# Altium schematic sheet LEL UDS.SchDoc
size A0
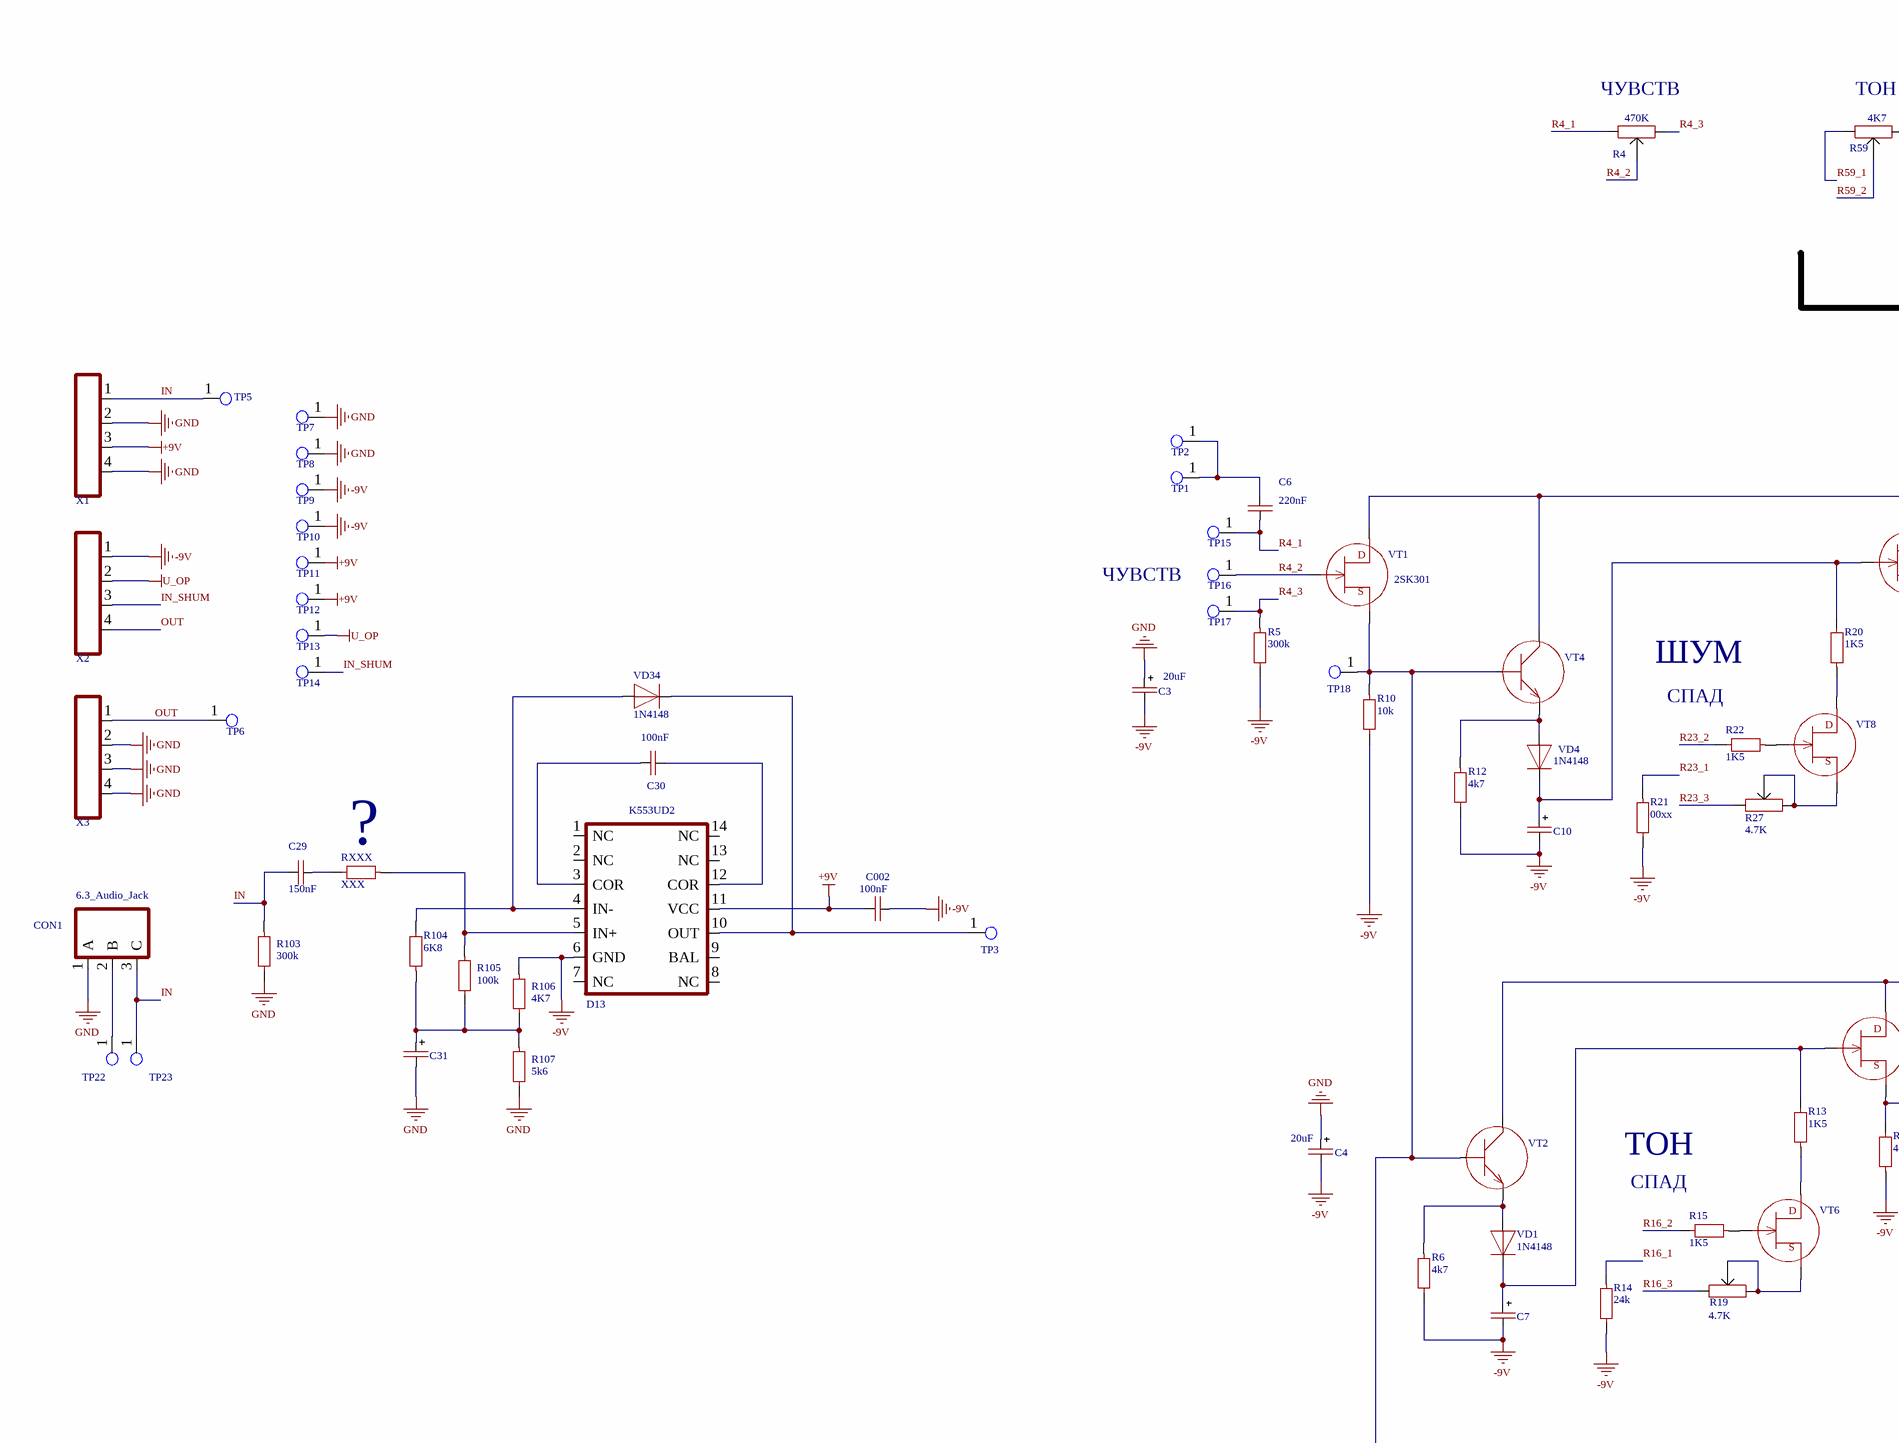
[diagram p0: LEL UDS.SchDoc, top left]
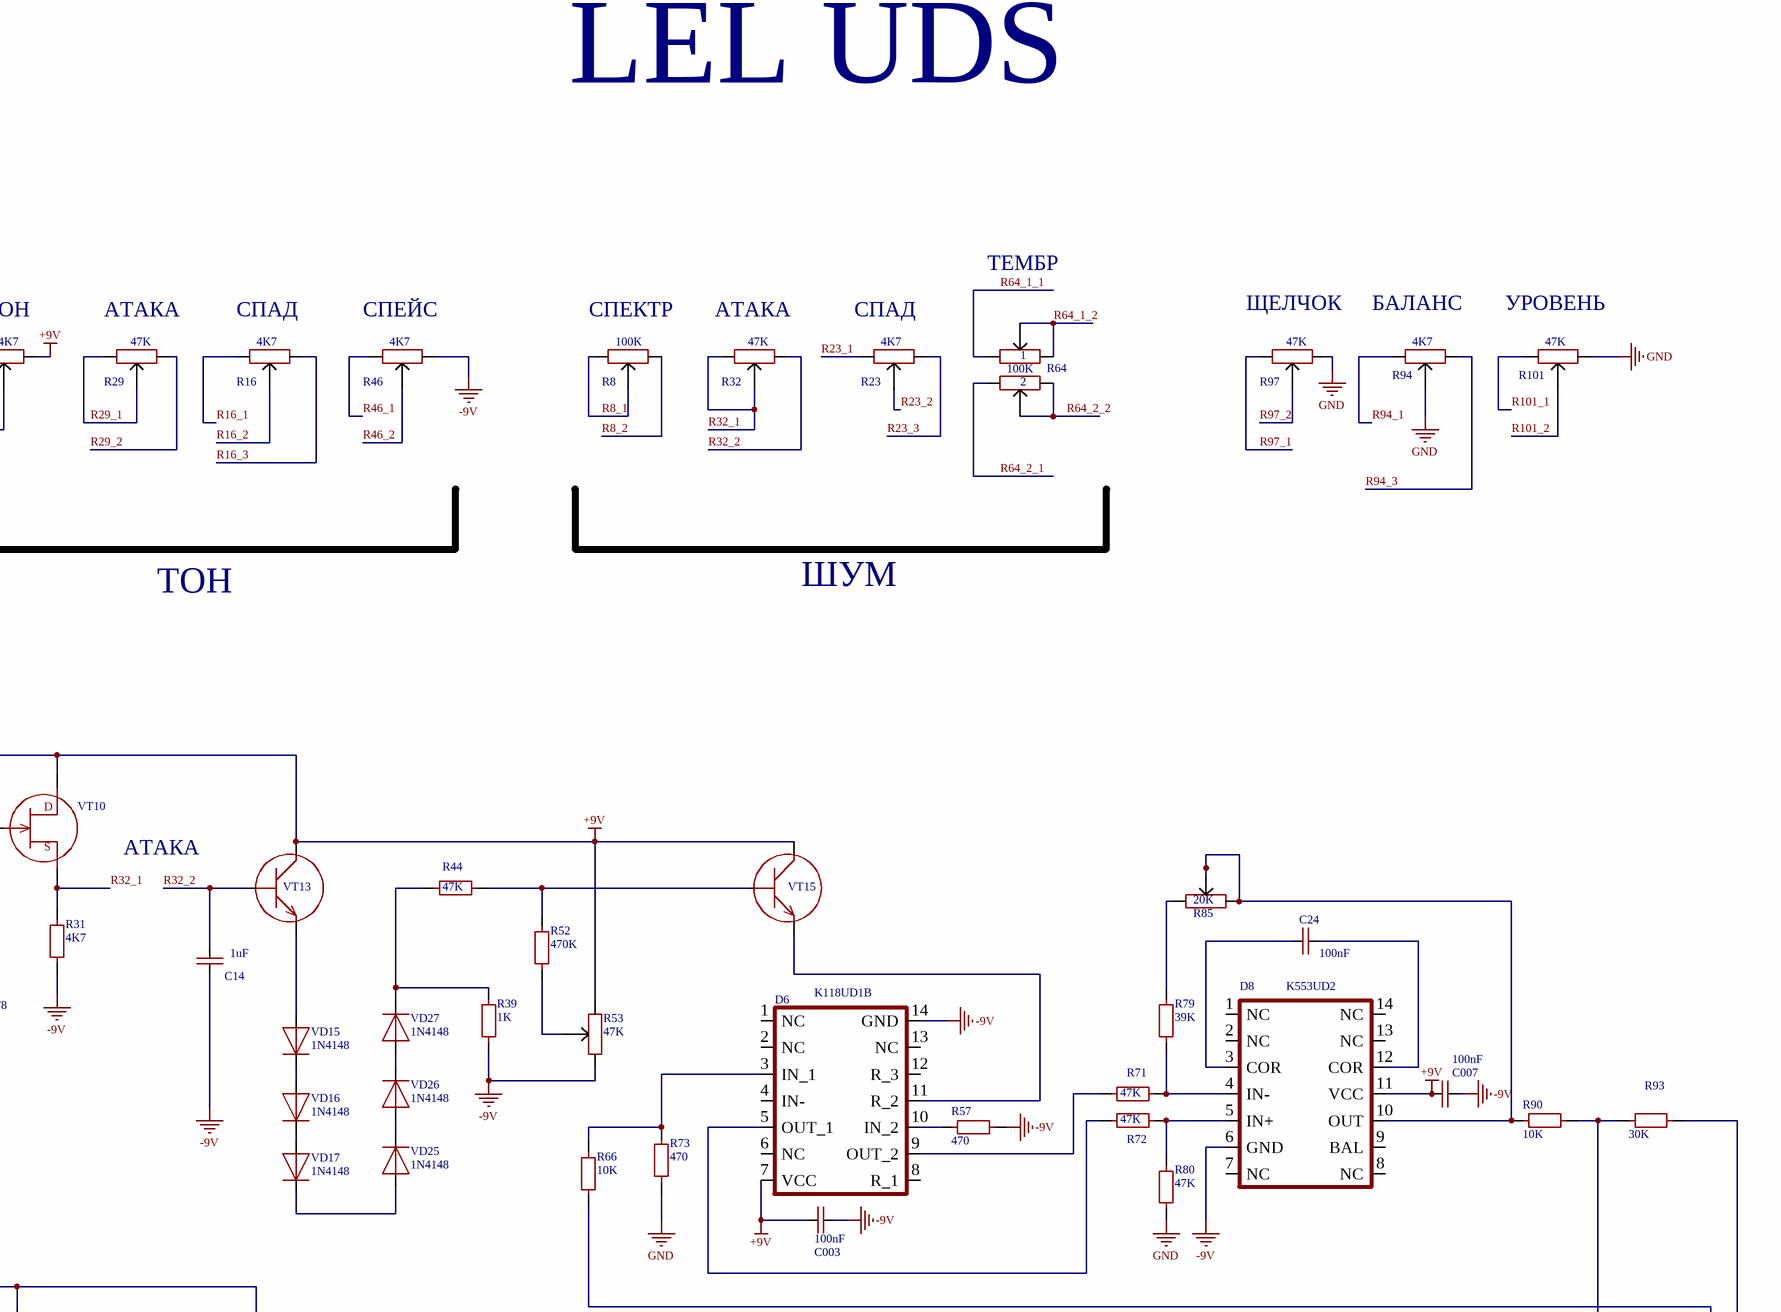
[diagram p1: LEL UDS.SchDoc, top right]
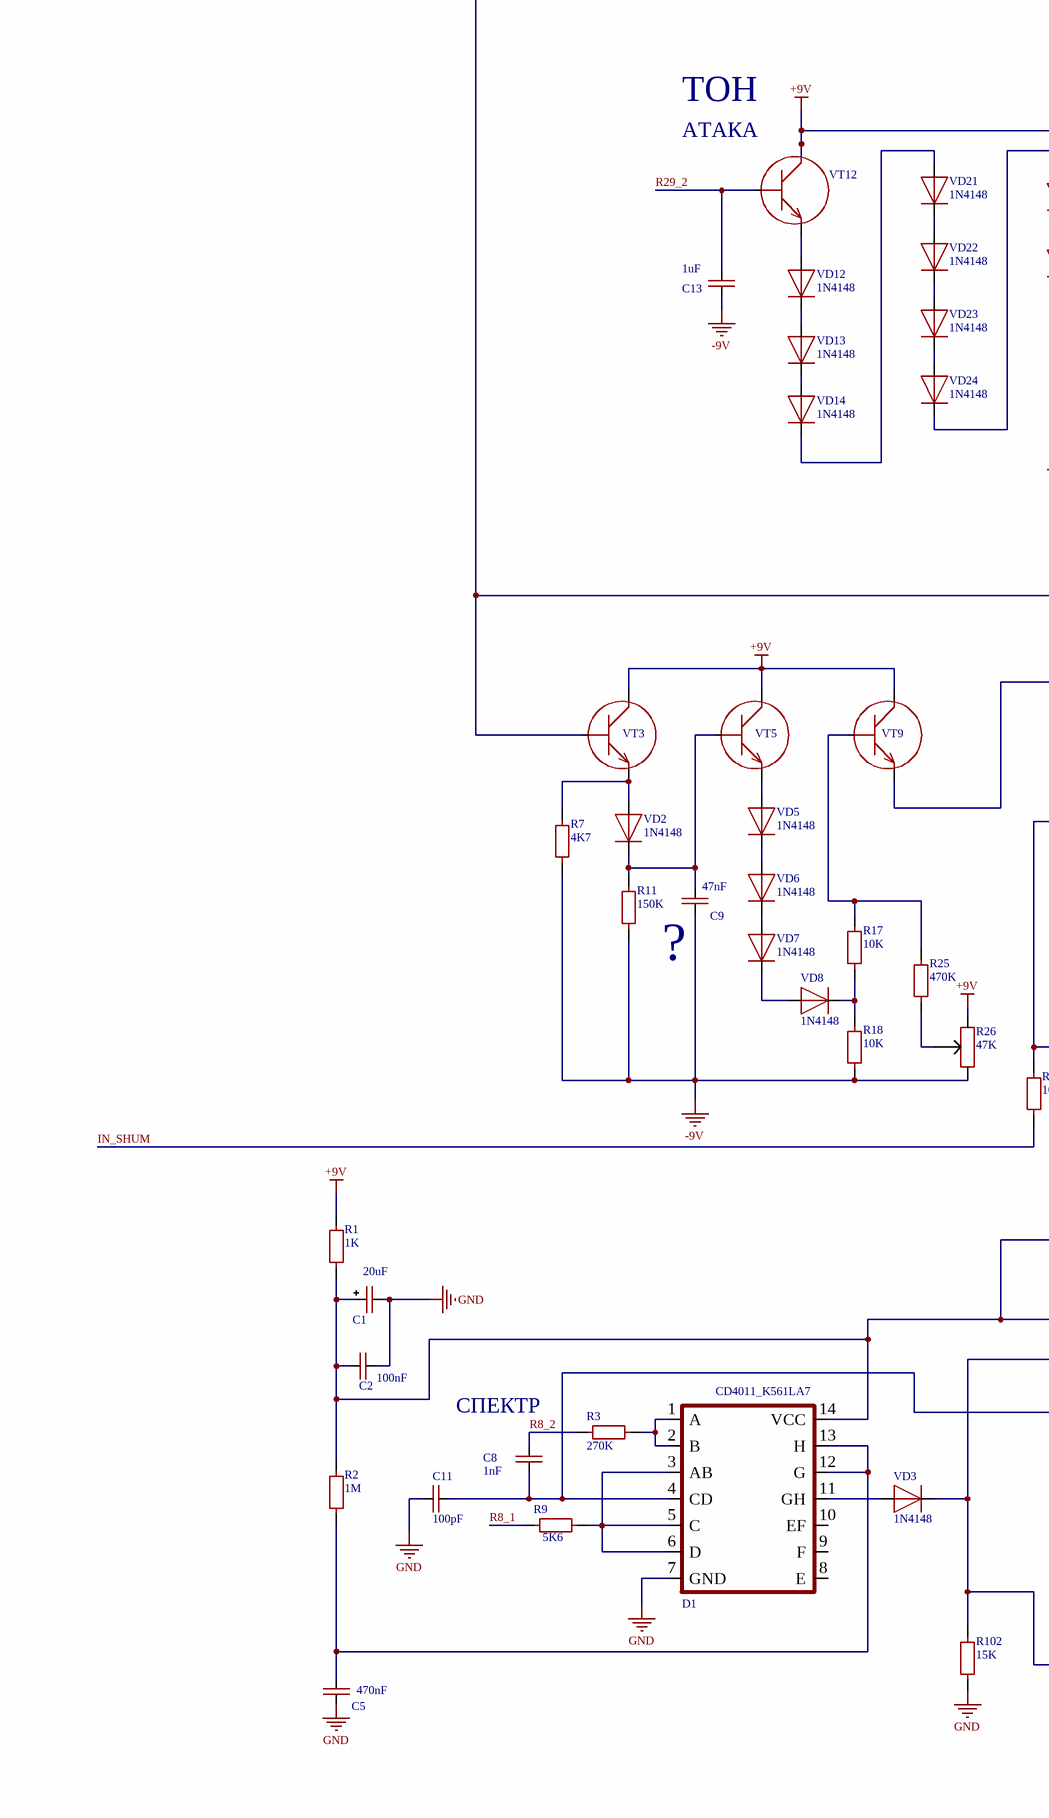
[diagram p2: LEL UDS.SchDoc, bottom left]
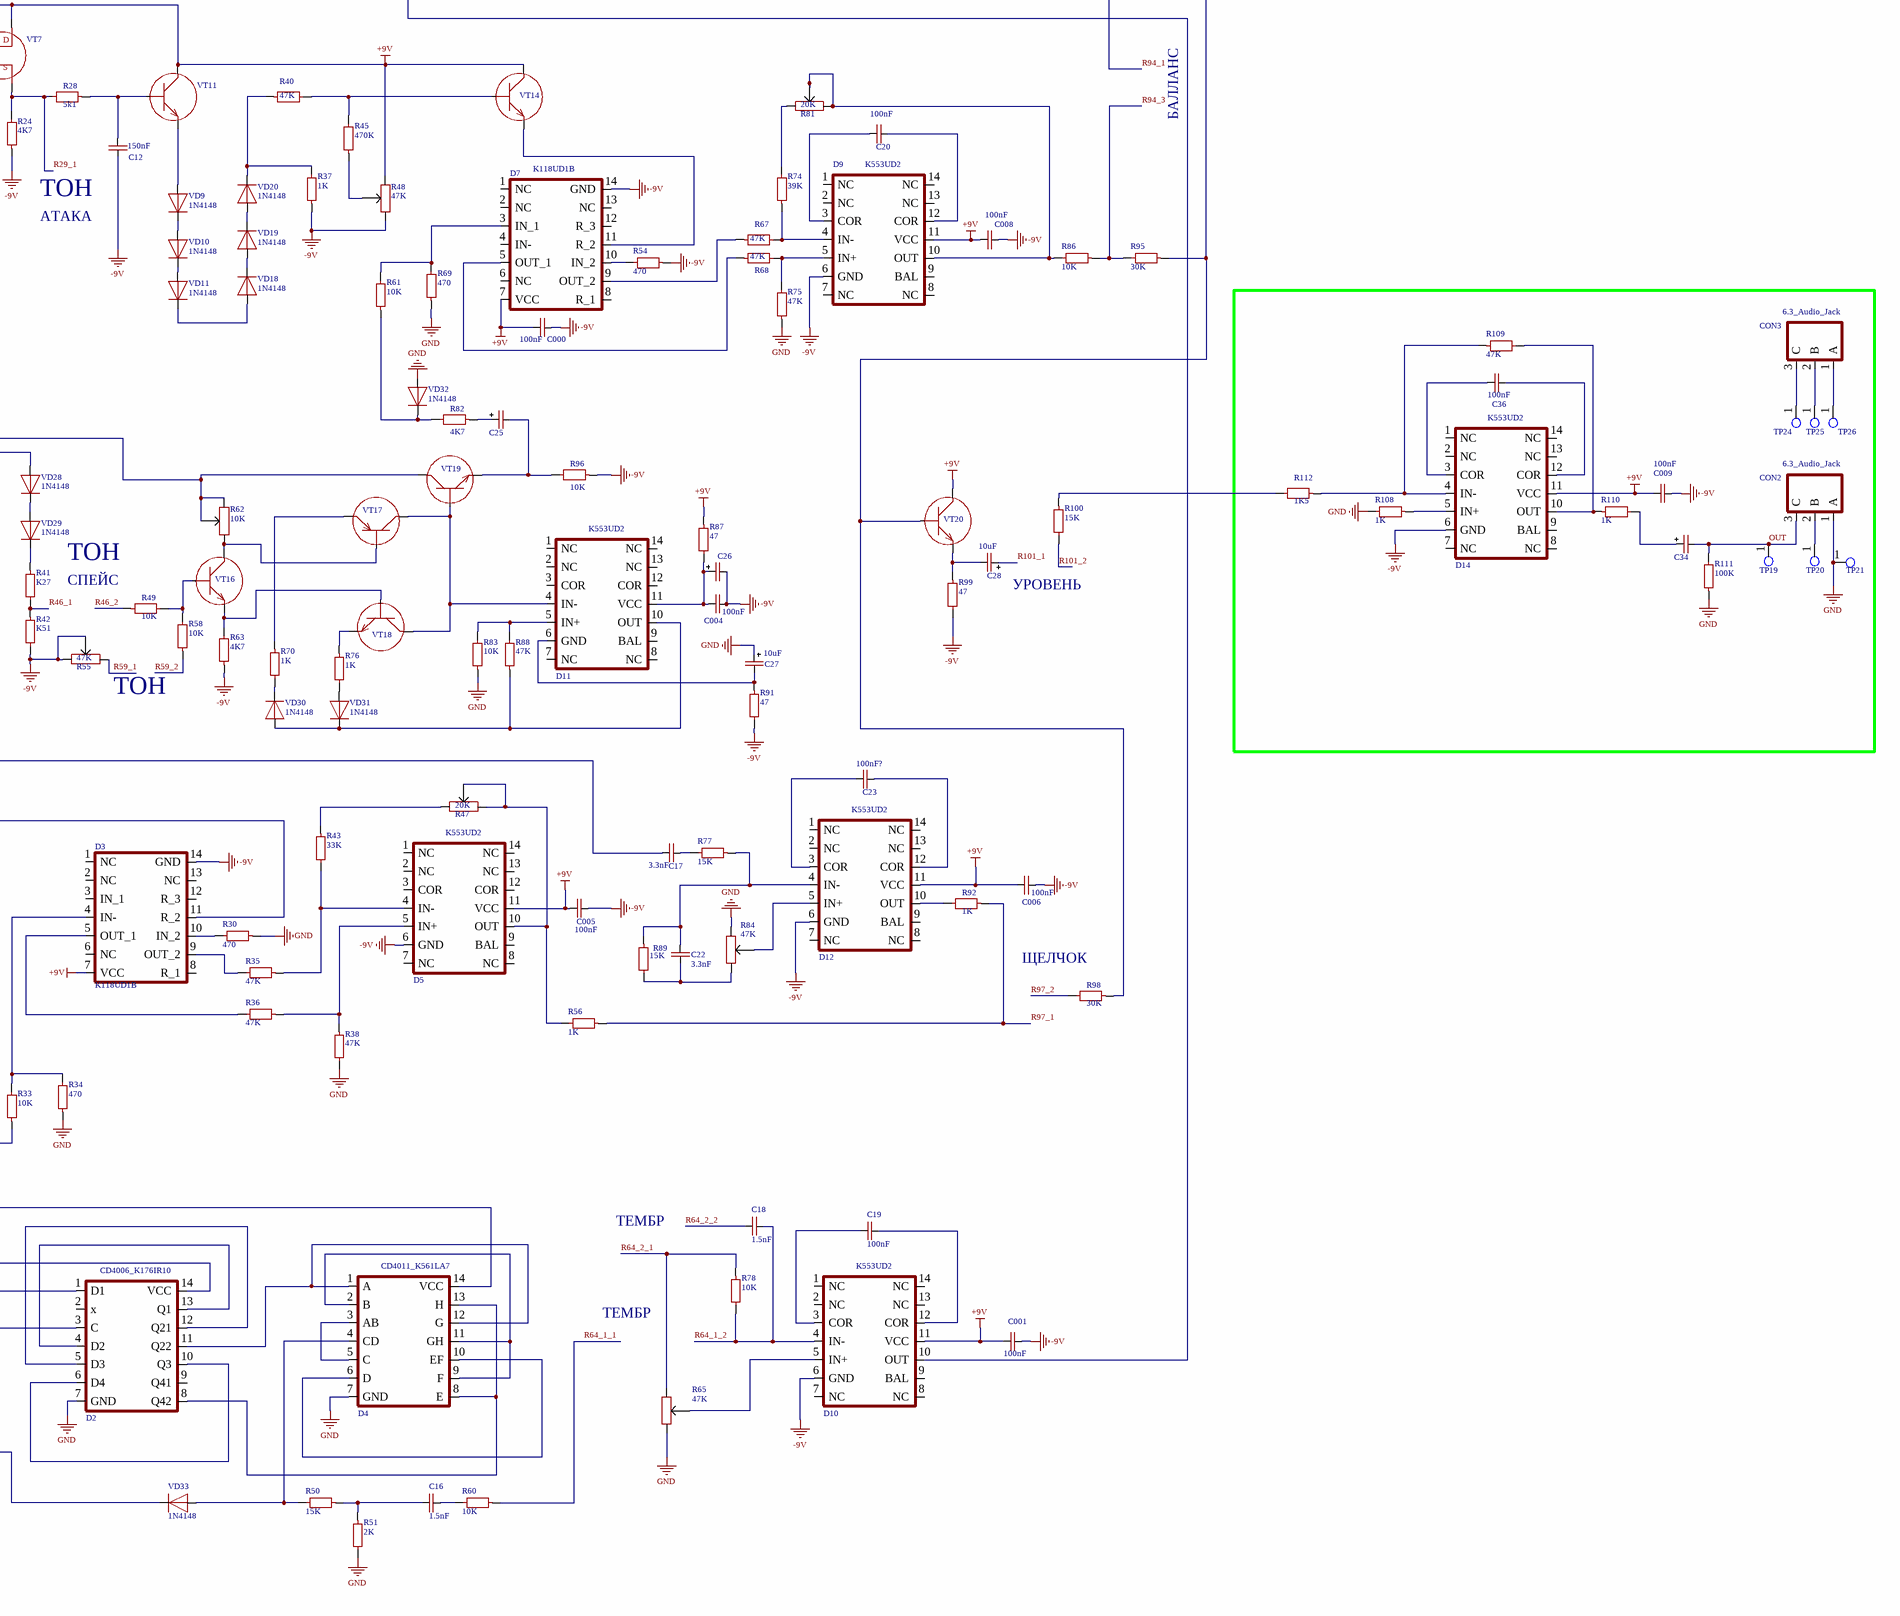
[diagram p3: LEL UDS.SchDoc, bottom right]

## Parts
C000  100nF  [CAP-0805]
C001  100nF  [CAP-0805]
C1  20uF  [CAPPOL8x12]
C002  100nF  [CAP-0805]
C2  100nF  [MKP 100nF 275VAC]
C3  20uF  [CAPPOL8x12]
C003  100nF  [CAP-0805]
C004  100nF  [CAP-0805]
C4  20uF  [CAPPOL8x12]
C005  100nF  [CAP-0805]
C5  470nF  [MKP 100nF 275VAC]
C006  100nF  [CAP-0805]
C6  220nF  [MKP 100nF 275VAC]
C007  100nF  [CAP-0805]
C7  CAP-POLAR  [CAPPOL8x12]  (value not drawn)
C008  100nF  [CAP-0805]
C8  1nF  [CAP-0805]
C009  100nF  [CAP-0805]
C9  47nF  [CAP-0805]
C10  CAP-POLAR  [CAPPOL8x12]  (value not drawn)
C11  100pF  [CAP-0805]
C12  150nF  [MKP 100nF 275VAC]
C13  1uF  [MKP 100nF 275VAC]
C14  1uF  [MKP 100nF 275VAC]
C16  1.5nF  [CAP-0805]
C17  3.3nF  [CAP-0805]
C18  1.5nF  [CAP-0805]
C19  100nF  [CAP-0805]
C20  100nF  [CAP-0805]
C22  3.3nF  [CAP-0805]
C23  100nF?  [CAP-0805]
C24  100nF  [CAP-0805]
C25  CAP-POLAR  [CAPPOL8x12]  (value not drawn)
C26  CAP-POLAR  [CAPPOL8x12]  (value not drawn)
C27  10uF  [CAPPOL8x12]
C28  10uF  [CAPPOL8x12]
C29  150nF  [MKP 100nF 275VAC]
C30  100nF  [CAP-0805]
C31  20uF  [CAPPOL8x12]  (value not drawn)
C34  CAP-POLAR  [CAPPOL8x12]  (value not drawn)
C36  100nF  [CAP-0805]
CON1  6.3_Audio_Jack  [6.3_Audio_Jack]
CON2  6.3_Audio_Jack  [6.3_Audio_Jack]
CON3  6.3_Audio_Jack  [6.3_Audio_Jack]
D1  СD4011_K561LA7  [DIP14]
D2  CD4006_K176IR10  [DIP14]
D3  K118UD1B  [DIP14]
D4  СD4011_K561LA7  [DIP14]
D5  K553UD2  [DIP14]
D6  K118UD1B  [DIP14]
D7  K118UD1B  [DIP14]
D8  K553UD2  [DIP14]
D9  K553UD2  [DIP14]
D10  K553UD2  [DIP14]
D11  K553UD2  [DIP14]
D12  K553UD2  [DIP14]
D13  K553UD2  [DIP14]
D14  K553UD2  [DIP14]
R1  1K  [RES-0805]
R2  1M  [RES-0805]
R3  270K  [RES-0805]
R4  470K  [RES_VAR_1]
R5  300k  [RES-0805]
R6  4k7  [RES-0805]
R7  4K7  [RES-0805]
R8  100K  [RES_VAR_1]
R9  5K6  [RES-0805]
R10  10k  [RES-0805]
R11  150K  [RES-0805]
R12  4k7  [RES-0805]
R13  1K5  [RES-0805]
R14  24k  [RES-0805]
R15  1K5  [RES-0805]
R16  4K7  [RES_VAR_1]
R17  10K  [RES-0805]
R18  10K  [RES-0805]
R19  4.7K  [RES_VAR_RM-065]
R20  1K5  [RES-0805]
R21  00xx  [RES-0805]
R22  1K5  [RES-0805]
R23  4K7  [RES_VAR_1]
R24  4K7  [RES-0805]
R25  470K  [RES-0805]
R26  47K  [RES_VAR_RM-065]
R27  4.7K  [RES_VAR_RM-065]
R28  5k1  [RES-0805]
R29  47K  [RES_VAR_1]
R30  470  [RES-0805]
R31  4K7  [RES-0805]
R32  47K  [RES_VAR_1]
R33  10K  [RES-0805]
R34  470  [RES-0805]
R35  47K  [RES-0805]
R36  47K  [RES-0805]
R37  1K  [RES-0805]
R38  47K  [RES-0805]
R39  1K  [RES-0805]
R40  47K  [RES-0805]
R41  K27  [RES-0805]
R42  K51  [RES-0805]
R43  33K  [RES-0805]
R44  47K  [RES-0805]
R45  470K  [RES-0805]
R46  4K7  [RES_VAR_1]
R47  20K  [RES_VAR_RM-065]
R48  47K  [RES_VAR_RM-065]
R49  10K  [RES-0805]
R50  15K  [RES-0805]
R51  2K  [RES-0805]
R52  470K  [RES-0805]
R53  47K  [RES_VAR_RM-065]
R54  470  [RES-0805]
R55  47K  [RES_VAR_RM-065]
R56  1K  [RES-0805]
R57  470  [RES-0805]
R58  10K  [RES-0805]
R59  4K7  [RES_VAR_1]
R60  10K  [RES-0805]
R61  10K  [RES-0805]
R62  10K  [RES_VAR_RM-065]
R63  4K7  [RES-0805]
R64  100K  [RES_VAR_2]
R65  47K  [RES_VAR_RM-065]
R66  10K  [RES-0805]
R67  47K  [RES-0805]
R68  47K  [RES-0805]
R69  470  [RES-0805]
R70  1K  [RES-0805]
R71  47K  [RES-0805]
R72  47K  [RES-0805]
R73  470  [RES-0805]
R74  39K  [RES-0805]
R75  47K  [RES-0805]
R76  1K  [RES-0805]
R77  15K  [RES-0805]
R78  10K  [RES-0805]
R79  39K  [RES-0805]
R80  47K  [RES-0805]
R81  20K  [RES_VAR_RM-065]
R82  4K7  [RES-0805]
R83  10K  [RES-0805]
R84  47K  [RES_VAR_RM-065]
R85  20K  [RES_VAR_RM-065]
R86  10K  [RES-0805]
R87  47  [RES-0805]
R88  47K  [RES-0805]
R89  15K  [RES-0805]
R90  10K  [RES-0805]
R91  47  [RES-0805]
R92  1K  [RES-0805]
R93  30K  [RES-0805]
R94  4K7  [RES_VAR_1]
R95  30K  [RES-0805]
R96  10K  [RES-0805]
R97  47K  [RES_VAR_1]
R98  30K  [RES-0805]
R99  47  [RES-0805]
R100  15K  [RES-0805]
R101  47K  [RES_VAR_1]
R102  15K  [RES-0805]
R103  300k  [RES-0805]
R104  6K8  [RES-0805]
R105  100k  [RES-0805]
R106  4K7  [RES-0805]
R107  5k6  [RES-0805]
R108  1K  [RES-0805]
R109  47K  [RES-0805]
R110  1K  [RES-0805]
R111  100K  [RES-0805]
R112  1K5  [RES-0805]
RXXX  XXX  [RES-0805]
TP1  Test_Point_PCB  [Test_Point]  (value not drawn)
TP2  Test_Point_PCB  [Test_Point]  (value not drawn)
TP3  Test_Point_PCB  [Test_Point]  (value not drawn)
TP5  Test_Point_PCB  [Test_Point]  (value not drawn)
TP6  Test_Point_PCB  [Test_Point]  (value not drawn)
TP7  Test_Point_PCB  [Test_Point]  (value not drawn)
TP8  Test_Point_PCB  [Test_Point]  (value not drawn)
TP9  Test_Point_PCB  [Test_Point]  (value not drawn)
TP10  Test_Point_PCB  [Test_Point]  (value not drawn)
TP11  Test_Point_PCB  [Test_Point]  (value not drawn)
TP12  Test_Point_PCB  [Test_Point]  (value not drawn)
TP13  Test_Point_PCB  [Test_Point]  (value not drawn)
TP14  Test_Point_PCB  [Test_Point]  (value not drawn)
TP15  Test_Point_PCB  [Test_Point]  (value not drawn)
TP16  Test_Point_PCB  [Test_Point]  (value not drawn)
TP17  Test_Point_PCB  [Test_Point]  (value not drawn)
TP18  Test_Point_PCB  [Test_Point]  (value not drawn)
TP19  Test_Point_PCB  [Test_Point]  (value not drawn)
TP20  Test_Point_PCB  [Test_Point]  (value not drawn)
TP21  Test_Point_PCB  [Test_Point]  (value not drawn)
TP22  Test_Point_PCB  [Test_Point]  (value not drawn)
TP23  Test_Point_PCB  [Test_Point]  (value not drawn)
TP24  Test_Point_PCB  [Test_Point]  (value not drawn)
TP25  Test_Point_PCB  [Test_Point]  (value not drawn)
TP26  Test_Point_PCB  [Test_Point]  (value not drawn)
VD1  1N4148  [SOD-123]
VD2  1N4148  [SOD-123]
VD3  1N4148  [SOD-123]
VD4  1N4148  [SOD-123]
VD5  1N4148  [SOD-123]
VD6  1N4148  [SOD-123]
VD7  1N4148  [SOD-123]
VD8  1N4148  [SOD-123]
VD9  1N4148  [SOD-123]
VD10  1N4148  [SOD-123]
VD11  1N4148  [SOD-123]
VD12  1N4148  [SOD-123]
VD13  1N4148  [SOD-123]
VD14  1N4148  [SOD-123]
VD15  1N4148  [SOD-123]
VD16  1N4148  [SOD-123]
VD17  1N4148  [SOD-123]
VD18  1N4148  [SOD-123]
VD19  1N4148  [SOD-123]
VD20  1N4148  [SOD-123]
VD21  1N4148  [SOD-123]
VD22  1N4148  [SOD-123]
VD23  1N4148  [SOD-123]
VD24  1N4148  [SOD-123]
VD25  1N4148  [SOD-123]
VD26  1N4148  [SOD-123]
VD27  1N4148  [SOD-123]
VD28  1N4148  [SOD-123]
VD29  1N4148  [SOD-123]
VD30  1N4148  [SOD-123]
VD31  1N4148  [SOD-123]
VD32  1N4148  [SOD-123]
VD33  1N4148  [SOD-123]
VD34  1N4148  [SOD-123]
VT1  2SK301  [TO-92]
VT2  BC847-BEC  [SOT23-3]  (value not drawn)
VT3  BC847-BEC  [SOT23-3]  (value not drawn)
VT4  BC847-BEC  [SOT23-3]  (value not drawn)
VT5  BC847-BEC  [SOT23-3]  (value not drawn)
VT6  2SK301  [TO-92]  (value not drawn)
VT7  2SK301  [TO-92]  (value not drawn)
VT8  2SK301  [TO-92]  (value not drawn)
VT9  BC847-BEC  [SOT23-3]  (value not drawn)
VT10  2SK301  [TO-92]  (value not drawn)
VT11  BC847-BEC  [SOT23-3]  (value not drawn)
VT12  BC847-BEC  [SOT23-3]  (value not drawn)
VT13  BC847-BEC  [SOT23-3]  (value not drawn)
VT14  BC847-BEC  [SOT23-3]  (value not drawn)
VT15  BC847-BEC  [SOT23-3]  (value not drawn)
VT16  BC847-BEC  [SOT23-3]  (value not drawn)
VT17  BC857-BEC  [SOT23-3]  (value not drawn)
VT18  BC847-BEC  [SOT23-3]  (value not drawn)
VT19  BC847-BEC  [SOT23-3]  (value not drawn)
VT20  BC847-BEC  [SOT23-3]  (value not drawn)
X1  CONN-4-PIN  [CONN-PLS-4-2.54mm]  (value not drawn)
X2  CONN-4-PIN  [CONN-PLS-4-2.54mm]  (value not drawn)
X3  CONN-4-PIN  [CONN-PLS-4-2.54mm]  (value not drawn)

## Nets
+9V: C000.1 C001.1 C002.1 C003.1 C005.1 C006.1 C007.1 C008.1 C009.1 D3.7(VCC) D5.11(VCC) D6.7(VCC) D7.7(VCC) D8.11(VCC) D9.11(VCC) D10.11(VCC) D12.11(VCC) D13.11(VCC) D14.11(VCC) R1.2 R26.3 R48.3 R53.3 R59.1 R62.2 R62.3 R87.1 TP11.1(G9) TP12.1(G9) VT1.1(D) VT2.3(C) VT3.3(C) VT4.3(C) VT5.3(C) VT7.1(D) VT9.3(C) VT10.1(D) VT11.3(C) VT12.3(C) VT13.3(C) VT14.3(C) VT15.3(C) VT19.3(C) VT20.3(C) X1.3
-9V: C000.2 C001.2 C002.2 C3.2(-) C003.2 C004.2 C4.2(-) C005.2 C006.2 C007.2 C7.2(-) C008.2 C9.1 C009.2 C10.2(-) C12.1 C13.1 C14.1 C26.2(-) D3.14(GND) D5.6(GND) D6.14(GND) D7.14(GND) D8.6(GND) D9.6(GND) D10.6(GND) D12.6(GND) D13.6(GND) D14.6(GND) R5.2 R6.2 R7.1 R10.2 R11.1 R12.2 R14.2 R18.1 R21.2 R24.1 R26.1 R31.1 R37.1 R39.1 R42.2 R46.1 R48.1 R53.1 R54.1 R55.1 R55.2 R57.1 R63.1 R91.2 R96.1 R99.2 R106.1 TP9.1(G9) TP10.1(G9) X2.1
GND: C1.2(-) C2.2 C3.1(+) C4.1(+) C5.1 C11.2 C27.1(+) C31.2(-) CON1.1(A) CON2.1(A) D1.7(GND) D2.7(GND) D4.7(GND) R30.1 R34.1 R38.2 R51.2 R65.3 R69.1 R73.1 R75.1 R80.1 R83.1 R84.1 R94.2 R97.1 R101.1 R102.1 R103.2 R107.2 R108.2 R111.1 TP7.1(G9) TP8.1(G9) TP21.1(G9) VD32.2(A) X1.2 X1.4 X3.2 X3.3 X3.4
U_OP: TP13.1(G9) X2.2
IN: C29.1 CON1.3(C) R103.1 TP5.1(G9) TP23.1(G9) X1.1
IN_SHUM: R33.1 TP14.1(G9) X2.3
OUT: C34.2(-) CON2.3(C) R111.2 TP6.1(G9) TP19.1(G9) X2.4 X3.1
R4_1: C6.1 R4.3 TP15.1(G9)
R4_2: R4.2 TP16.1(G9) VT1.2(G)
R4_3: R4.1 R5.1 TP17.1(G9)
R8_1: R8.2 R8.3 R9.2
R8_2: C8.2 R3.2 R8.1
R16_1: R14.1 R16.3
R16_2: R15.2 R16.2
R16_3: R16.1 R19.1
R23_1: R21.1 R23.3
R23_2: R22.2 R23.2
R23_3: R23.1 R27.1
R29_1: R24.2 R28.2 R29.2 R29.3 VT7.3(S)
R29_2: C13.2 R29.1 VT12.1(B)
R32_1: R31.2 R32.2 R32.3 VT10.3(S)
R32_2: C14.2 R32.1 VT13.1(B)
R46_1: R41.2 R42.1 R46.3
R46_2: R46.2 R49.1
R59_1: R55.3 R59.3
R59_2: R58.1 R59.2
R64_1_1: R60.1 R64.1
R64_1_2: C18.2 D10.4(IN-) R64.2 R64.3 R78.2
R64_2_1: R64.6 R65.1 R78.1
R64_2_2: C18.1 R64.4 R64.5
R94_1: R90.1 R93.2 R94.3
R94_3: R86.1 R94.1 R95.2
R97_1: R56.1 R92.1 R97.3
R97_2: R97.2 R98.2
R101_1: C28.1(+) R101.3
R101_2: R100.2 R101.2
NetC1_1: C1.1(+) C2.1 D1.14(VCC) D2.14(VCC) D4.14(VCC) R1.1 R2.2
NetC004_1: C004.1 C26.1(+) D11.11(VCC) R87.2
NetC5_2: C5.2 D1.12(G) D1.13(H) R2.1
NetC6_2: C6.2 TP1.1(G9) TP2.1(G9)
NetC7_1: C7.1(+) R13.2 VD1.1(C) VT7.2(G)
NetC8_1: C8.1 C11.1 D1.4(CD) D2.3(C)
NetC9_2: C9.2 R11.2 VD2.1(C) VT5.1(B)
NetC10_1: C10.1(+) R20.2 VD4.1(C) VT10.2(G)
NetC12_2: C12.2 R28.1 VT11.1(B)
NetC16_1: C16.1 R60.2
NetC16_2: C16.2 R50.1 R51.1
NetC17_1: C17.1 R10.1 TP18.1(G9) VT1.3(S) VT2.1(B) VT3.1(B) VT4.1(B)
NetC17_2: C17.2 R77.2
NetC19_1: C19.1 D10.3(COR)
NetC19_2: C19.2 D10.12(COR)
NetC20_1: C20.1 D9.3(COR)
NetC20_2: C20.2 D9.12(COR)
NetC22_1: C22.1 R84.3 R89.2
NetC22_2: C22.2 D12.4(IN-) R77.1 R89.1
NetC23_1: C23.1 D12.3(COR)
NetC23_2: C23.2 D12.12(COR)
NetC24_1: C24.1 D8.3(COR)
NetC24_2: C24.2 D8.12(COR)
NetC25_1: C25.1(+) R82.1
NetC25_2: C25.2(-) R96.2 VT19.2(E)
NetC27_2: C27.2(-) D11.6(GND) R91.1
NetC28_2: C28.2(-) R99.1 VT20.2(E)
NetC29_2: C29.2 RXXX.2
NetC30_1: C30.1 D13.3(COR)
NetC30_2: C30.2 D13.12(COR)
NetC31_1: C31.1(+) R104.1 R105.2 R106.2 R107.1
NetC34_1: C34.1(+) R110.2
NetC36_1: C36.1 D14.3(COR)
NetC36_2: C36.2 D14.12(COR)
NetCON1_2: CON1.2(B) TP22.1(G9)
NetCON2_2: CON2.2(B) TP20.1(G9)
NetCON3_1: CON3.1(A) TP26.1(G9)
NetCON3_2: CON3.2(B) TP25.1(G9)
NetCON3_3: CON3.3(C) TP24.1(G9)
NetD1_1: D1.1(A) D1.2(B) R3.1
NetD1_3: D1.3(AB) D1.5(C) D1.6(D) R9.1
NetD1_11: D1.11(GH) VD3.2(A)
NetD2_1: D2.1(D1) R102.2 VD3.1(C) VD33.1(C)
NetD2_4: D2.4(D2) D2.13(Q1)
NetD2_5: D2.5(D3) D2.12(Q21)
NetD2_6: D2.6(D4) D2.10(Q3)
NetD2_8: D2.8(Q42) D4.8(E) D4.13(H)
NetD2_11: D2.11(Q22) D4.1(A) D4.12(G)
NetD3_4: D3.4(IN-) R33.2 R34.2
NetD3_5: D3.5(OUT_1) R36.2
NetD3_9: D3.9(OUT_2) R35.2
NetD3_10: D3.10(IN_2) R30.2
NetD3_11: D3.11(R_2) VT9.2(E)
NetD4_2: D4.2(B) D4.9(F) D4.11(GH)
NetD4_3: D4.3(AB) D4.5(C)
NetD4_4: D4.4(CD) R50.2 VD33.2(A)
NetD4_6: D4.6(D) D4.10(EF)
NetD5_4: D5.4(IN-) R35.1 R43.2
NetD5_5: D5.5(IN+) R36.1 R38.1
NetD5_10: D5.10(OUT) R47.2 R47.3 R56.2
NetD6_3: D6.3(IN_1) R66.2 R73.2
NetD6_5: D6.5(OUT_1) R72.1
NetD6_9: D6.9(OUT_2) R71.1
NetD6_10: D6.10(IN_2) R57.2
NetD6_11: D6.11(R_2) VT15.2(E)
NetD7_3: D7.3(IN_1) R61.2 R69.2
NetD7_5: D7.5(OUT_1) R68.1
NetD7_9: D7.9(OUT_2) R67.1
NetD7_10: D7.10(IN_2) R54.2
NetD7_11: D7.11(R_2) VT14.2(E)
NetD8_4: D8.4(IN-) R71.2 R79.1
NetD8_5: D8.5(IN+) R72.2 R80.2
NetD8_10: D8.10(OUT) R85.2 R85.3 R90.2
NetD9_4: D9.4(IN-) R67.2 R74.1
NetD9_5: D9.5(IN+) R68.2 R75.2
NetD9_10: D9.10(OUT) R81.2 R81.3 R86.2
NetD10_5: D10.5(IN+) R65.2
NetD10_10: D10.10(OUT) R66.1
NetD11_4: D11.4(IN-) VT17.3(C) VT18.3(C) VT19.1(B)
NetD11_5: D11.5(IN+) R83.2 R88.2
NetD11_10: D11.10(OUT) R88.1 VD30.2(A) VD31.1(C)
NetD12_5: D12.5(IN+) R84.2
NetD12_10: D12.10(OUT) R92.2
NetD13_4: D13.4(IN-) R104.2 VD34.2(A)
NetD13_5: D13.5(IN+) R105.1 RXXX.1
NetD13_10: D13.10(OUT) TP3.1(G9) VD34.1(C)
NetD14_4: D14.4(IN-) R109.1 R112.1
NetD14_5: D14.5(IN+) R108.1
NetD14_10: D14.10(OUT) R109.2 R110.1
NetR6_1: R6.1 VD1.2(A) VT2.2(E)
NetR7_2: R7.2 VD2.2(A) VT3.2(E)
NetR12_1: R12.1 VD4.2(A) VT4.2(E)
NetR13_1: R13.1 VT6.1(D)
NetR15_1: R15.1 VT6.2(G)
NetR17_1: R17.1 R18.2 VD8.1(C)
NetR17_2: R17.2 R25.2 VT9.1(B)
NetR19_2: R19.2 R19.3 VT6.3(S)
NetR20_1: R20.1 VT8.1(D)
NetR22_1: R22.1 VT8.2(G)
NetR25_1: R25.1 R26.2
NetR27_2: R27.2 R27.3 VT8.3(S)
NetR37_2: R37.2 R40.1 VD20.1(C)
NetR39_2: R39.2 R44.1 VD27.1(C)
NetR40_2: R40.2 R45.2 VT14.1(B)
NetR41_1: R41.1 VD29.1(C)
NetR43_1: R43.1 R47.1
NetR44_2: R44.2 R52.2 VT15.1(B)
NetR45_1: R45.1 R48.2
NetR49_2: R49.2 R58.2 VT16.1(B)
NetR52_1: R52.1 R53.2
NetR61_1: R61.1 R82.2 VD32.1(C)
NetR62_1: R62.1 VT16.3(C) VT17.1(B)
NetR63_2: R63.2 VT16.2(E) VT18.1(B)
NetR70_1: R70.1 VT17.2(E)
NetR70_2: R70.2 VD30.1(C)
NetR74_2: R74.2 R81.1
NetR76_1: R76.1 VT18.2(E)
NetR76_2: R76.2 VD31.2(A)
NetR79_2: R79.2 R85.1
NetR93_1: R93.1 R95.1 R98.1 VT20.1(B)
NetR100_1: R100.1 R112.2
NetVD5_1: VD5.1(C) VD6.2(A)
NetVD5_2: VD5.2(A) VT5.2(E)
NetVD6_1: VD6.1(C) VD7.2(A)
NetVD7_1: VD7.1(C) VD8.2(A)
NetVD9_1: VD9.1(C) VD10.2(A)
NetVD9_2: VD9.2(A) VT11.2(E)
NetVD10_1: VD10.1(C) VD11.2(A)
NetVD11_1: VD11.1(C) VD18.2(A)
NetVD12_1: VD12.1(C) VD13.2(A)
NetVD12_2: VD12.2(A) VT12.2(E)
NetVD13_1: VD13.1(C) VD14.2(A)
NetVD14_1: VD14.1(C) VD21.2(A)
NetVD15_1: VD15.1(C) VD16.2(A)
NetVD15_2: VD15.2(A) VT13.2(E)
NetVD16_1: VD16.1(C) VD17.2(A)
NetVD17_1: VD17.1(C) VD25.2(A)
NetVD18_1: VD18.1(C) VD19.2(A)
NetVD19_1: VD19.1(C) VD20.2(A)
NetVD21_1: VD21.1(C) VD22.2(A)
NetVD22_1: VD22.1(C) VD23.2(A)
NetVD23_1: VD23.1(C) VD24.2(A)
NetVD24_1: VD24.1(C) VD28.2(A)
NetVD25_1: VD25.1(C) VD26.2(A)
NetVD26_1: VD26.1(C) VD27.2(A)
NetVD28_1: VD28.1(C) VD29.2(A)

Not connected (* = marked no-connect by the designer): D1 8(E) 9(F) 10(EF); D2 2(x) 9(Q41); D3 1(NC) 2(NC) 3(IN_1) 6(NC) 8(R_1) 12(R_3) 13(NC); D5 1(NC) 2(NC) 3(COR) 7(NC) 8(NC) 9(BAL) 12(COR) 13(NC) 14(NC); D6 1(NC) 2(NC) 4(IN-) 6(NC) 8(R_1) 12(R_3) 13(NC); D7 1(NC) 2(NC) 4(IN-) 6(NC) 8(R_1) 12(R_3) 13(NC); D8 1(NC) 2(NC) 7(NC) 8(NC) 9(BAL) 13(NC) 14(NC); D9 1(NC) 2(NC) 7(NC) 8(NC) 9(BAL) 13(NC) 14(NC); D10 1(NC) 2(NC) 7(NC) 8(NC) 9(BAL) 13(NC) 14(NC); D11 1(NC) 2(NC) 3(COR) 7(NC) 8(NC) 9(BAL) 12(COR) 13(NC) 14(NC); D12 1(NC) 2(NC) 7(NC) 8(NC) 9(BAL) 13(NC) 14(NC); D13 1(NC) 2(NC) 7(NC) 8(NC) 9(BAL) 13(NC) 14(NC); D14 1(NC) 2(NC) 7(NC) 8(NC) 9(BAL) 13(NC) 14(NC)

## Notes on the sheet
- LEL UDS
- (near R4) ЧУВСТВ
- (near R59) ТОН
- (near R29) АТАКА
- (near R16) СПАД
- (near R46) СПЕЙС
- (near R8) СПЕКТР
- (near R32) АТАКА
- (near R23) СПАД
- ТЕМБР
- (near R97) ЩЕЛЧОК
- (near R94) БАЛАНС
- (near R101) УРОВЕНЬ
- (near R64) 1
- (near R64) 2
- ШУМ
- ТОН
- ЧУВСТВ
- АТАКА
- (near R22) СПАД
- (near RXXX) ?
- БАЛЛАНС
- (near R15) СПАД
- (near VT12) АТАКА
- СПЕЙС
- (near C28) УРОВЕНЬ
- (near R55) ТОН
- (near R98) ЩЕЛЧОК
- (near C9) ?
- (near C8) СПЕКТР

## Library data of the parts
C000 C001 C002 C2 C003 C004 C005 C5 C006 C6 C007 C008 C8 C009 C9 C11-C14 C16-C20 C22-C24 C29 C30 C36 = CAP-NON-POLAR
C1 C3 C4 C27 C28 C31 = CAP-POLAR
R1-R3 R5-R7 R9-R15 R17 R18 R20-R22 R24 R25 R28 R30 R31 R33-R45 R49-R52 R54 R56-R58 R60 R61 R63 R66-R80 R82 R83 R86-R93 R95 R96 R98-R100 R102-R112 RXXX = RES-CONST
R4 R8 R16 R19 R23 R26 R27 R29 R32 R46-R48 R53 R55 R59 R62 R65 R81 R84 R85 R94 R97 R101 = RES_VAR_1
R64 = RES_VAR_2
TP1-TP3 TP5-TP26 = TP_PCB?: Test_Point
VD1-VD34 = STPS0520Z: 1N4148 SOD-123; Manufacturer: STMicroelectronics; ID: D-00009; In Stock: 3; Part Number: STPS0520Z; Value: STPS0520Z; ComponentLink1Description: Database URL; ComponentLink1URL: http://el.udtech.dev/component/423/detail
X1-X3 = PLS-4: 4-pin PLS Connector 2.54 mm pitch; Part Number: PLS-4; ID: X-00003; Value: PLS-4; In Stock: 50; ComponentLink1Description: Database URL; ComponentLink1URL: http://el.udtech.dev/component/23/detail